# Altium schematic sheet CPU_power.SchDoc
size 420 x 297 mm; SheetNumber: 4; SheetTotal: 17
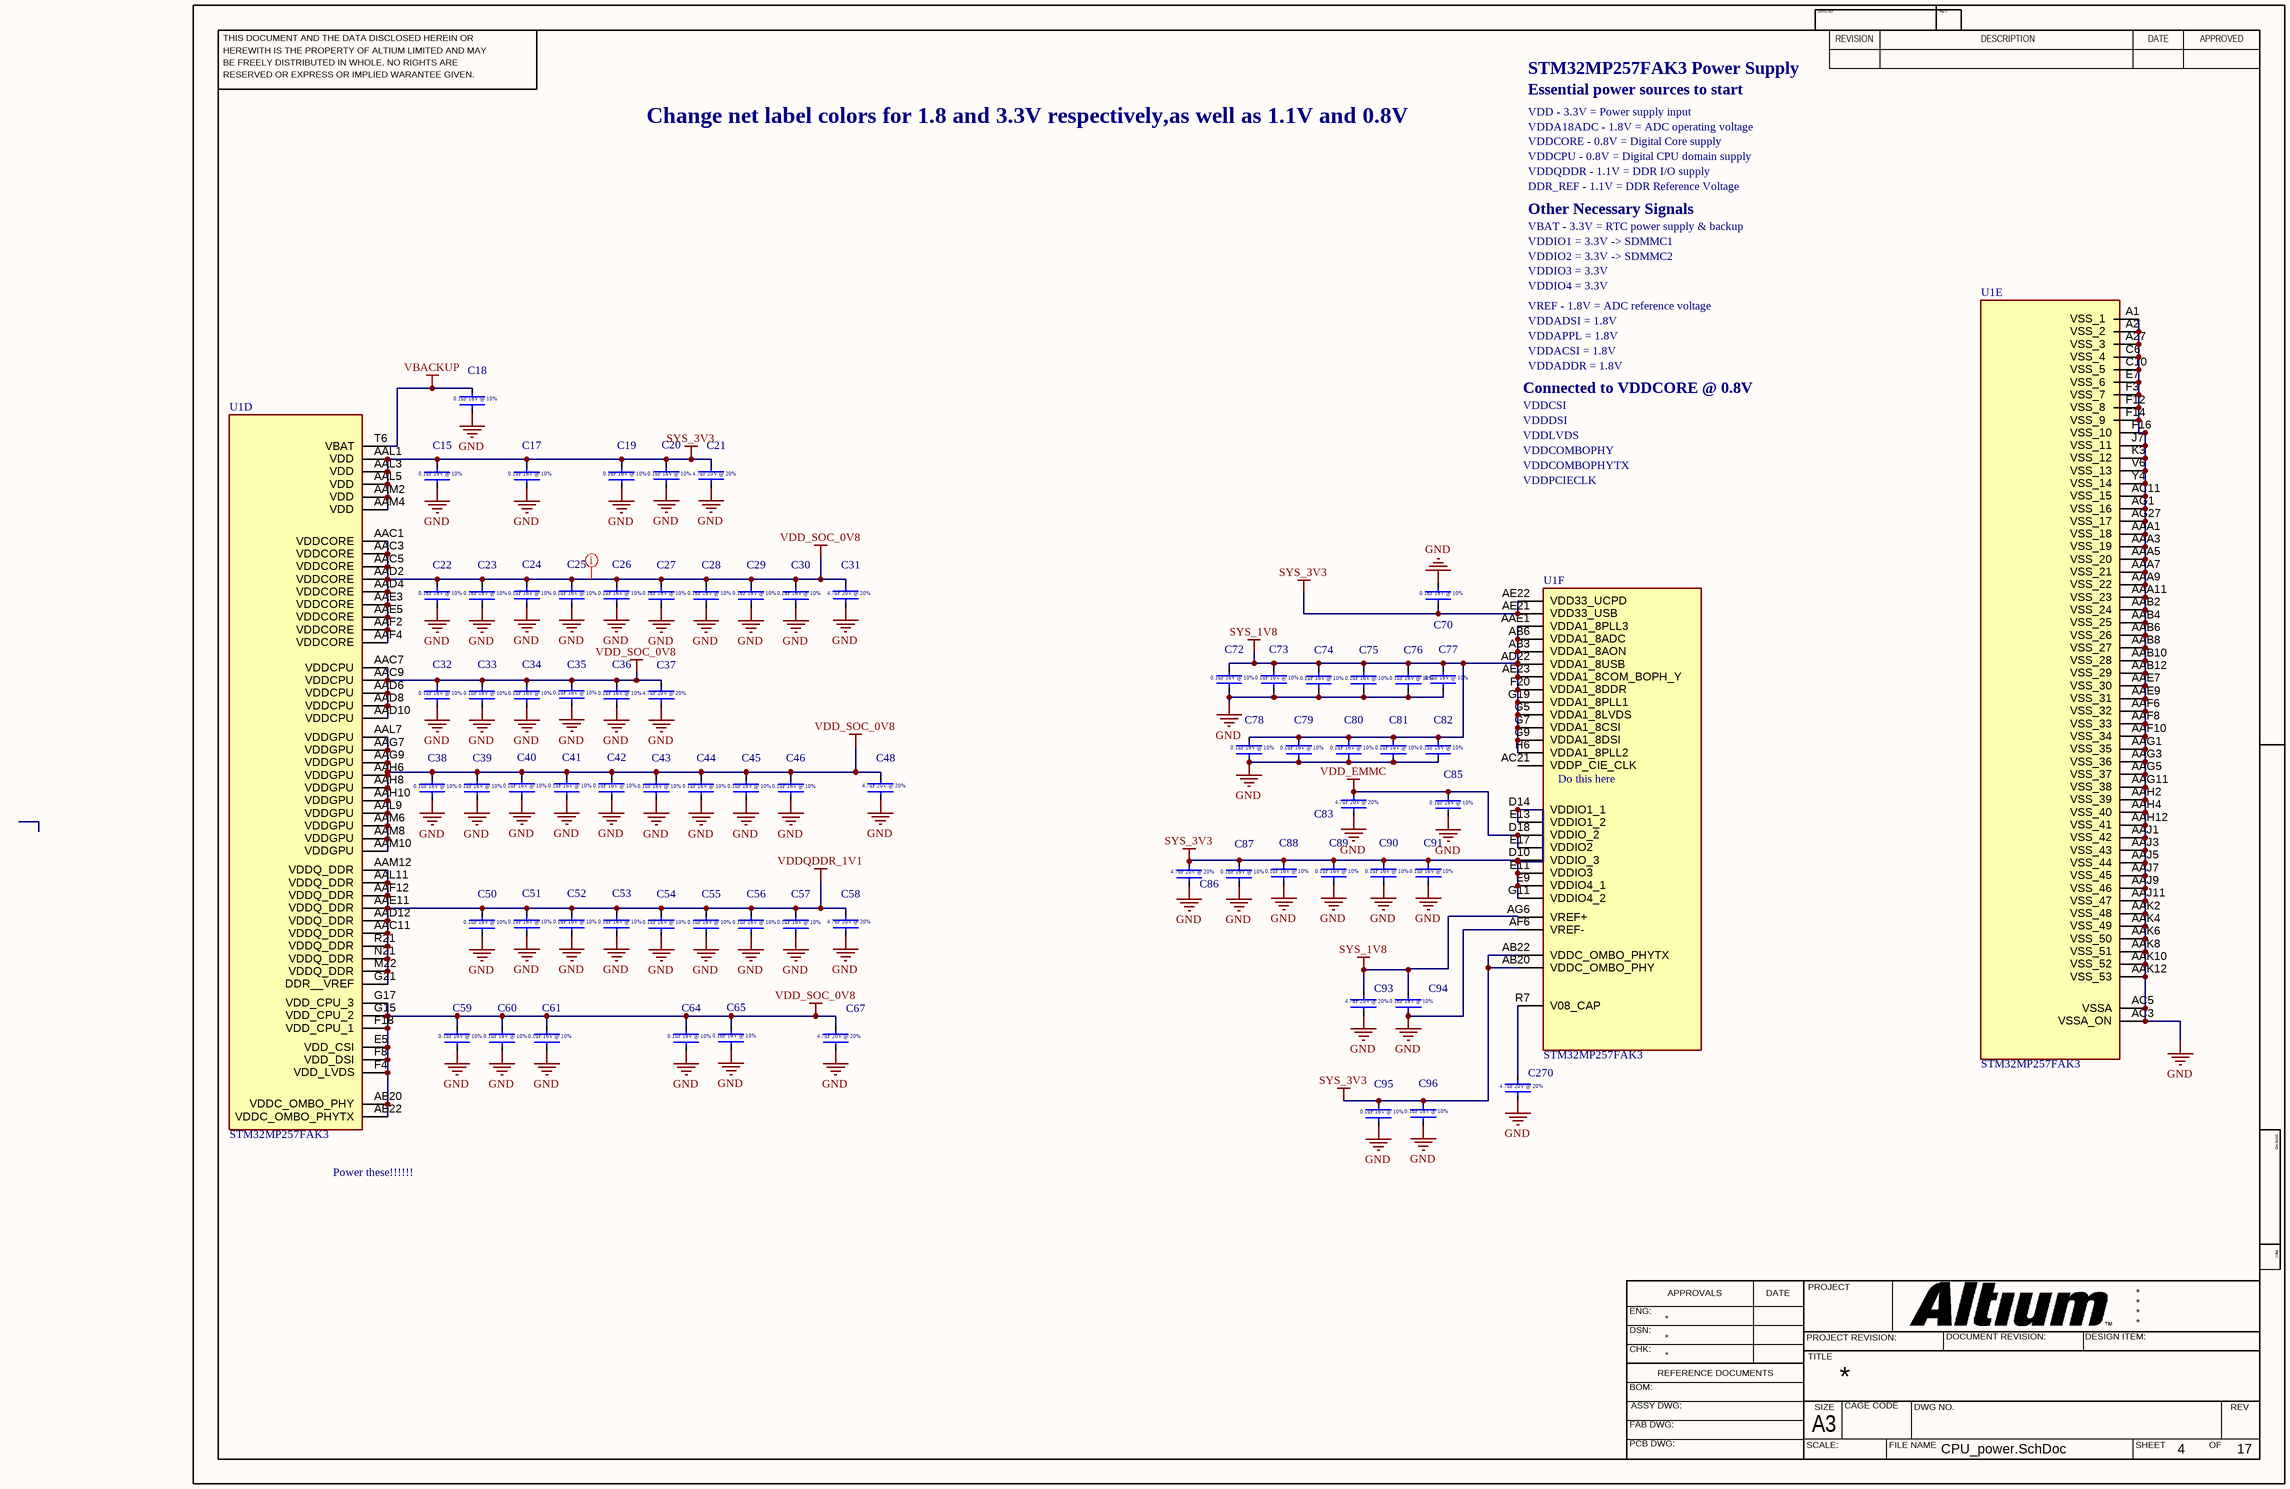
[diagram p0: CPU_power.SchDoc]

## Parts
C15  0.1uF  [CAPC0603X03L]  (value not drawn)
C17  0.1uF  [CAPC0603X03L]  (value not drawn)
C18  0.1uF  [CAPC0603X03L]  (value not drawn)
C19  0.1uF  [CAPC0603X03L]  (value not drawn)
C20  0.1uF  [CAPC0603X03L]  (value not drawn)
C21  4.7uF  [CAPC1005X06L]  (value not drawn)
C22  0.1uF  [CAPC0603X03L]  (value not drawn)
C23  0.1uF  [CAPC0603X03L]  (value not drawn)
C24  0.1uF  [CAPC0603X03L]  (value not drawn)
C25  0.1uF  [CAPC0603X03L]  (value not drawn)
C26  0.1uF  [CAPC0603X03L]  (value not drawn)
C27  0.1uF  [CAPC0603X03L]  (value not drawn)
C28  0.1uF  [CAPC0603X03L]  (value not drawn)
C29  0.1uF  [CAPC0603X03L]  (value not drawn)
C30  0.1uF  [CAPC0603X03L]  (value not drawn)
C31  4.7uF  [CAPC1005X06L]  (value not drawn)
C32  0.1uF  [CAPC0603X03L]  (value not drawn)
C33  0.1uF  [CAPC0603X03L]  (value not drawn)
C34  0.1uF  [CAPC0603X03L]  (value not drawn)
C35  0.1uF  [CAPC0603X03L]  (value not drawn)
C36  0.1uF  [CAPC0603X03L]  (value not drawn)
C37  4.7uF  [CAPC1005X06L]  (value not drawn)
C38  0.1uF  [CAPC0603X03L]  (value not drawn)
C39  0.1uF  [CAPC0603X03L]  (value not drawn)
C40  0.1uF  [CAPC0603X03L]  (value not drawn)
C41  0.1uF  [CAPC0603X03L]  (value not drawn)
C42  0.1uF  [CAPC0603X03L]  (value not drawn)
C43  0.1uF  [CAPC0603X03L]  (value not drawn)
C44  0.1uF  [CAPC0603X03L]  (value not drawn)
C45  0.1uF  [CAPC0603X03L]  (value not drawn)
C46  0.1uF  [CAPC0603X03L]  (value not drawn)
C48  4.7uF  [CAPC1005X06L]  (value not drawn)
C50  0.1uF  [CAPC0603X03L]  (value not drawn)
C51  0.1uF  [CAPC0603X03L]  (value not drawn)
C52  0.1uF  [CAPC0603X03L]  (value not drawn)
C53  0.1uF  [CAPC0603X03L]  (value not drawn)
C54  0.1uF  [CAPC0603X03L]  (value not drawn)
C55  0.1uF  [CAPC0603X03L]  (value not drawn)
C56  0.1uF  [CAPC0603X03L]  (value not drawn)
C57  0.1uF  [CAPC0603X03L]  (value not drawn)
C58  4.7uF  [CAPC1005X06L]  (value not drawn)
C59  0.1uF  [CAPC0603X03L]  (value not drawn)
C60  0.1uF  [CAPC0603X03L]  (value not drawn)
C61  0.1uF  [CAPC0603X03L]  (value not drawn)
C64  0.1uF  [CAPC0603X03L]  (value not drawn)
C65  0.1uF  [CAPC0603X03L]  (value not drawn)
C67  4.7uF  [CAPC1005X06L]  (value not drawn)
C70  0.1uF  [CAPC0603X03L]  (value not drawn)
C72  0.1uF  [CAPC0603X03L]  (value not drawn)
C73  0.1uF  [CAPC0603X03L]  (value not drawn)
C74  0.1uF  [CAPC0603X03L]  (value not drawn)
C75  0.1uF  [CAPC0603X03L]  (value not drawn)
C76  0.1uF  [CAPC0603X03L]  (value not drawn)
C77  0.1uF  [CAPC0603X03L]  (value not drawn)
C78  0.1uF  [CAPC0603X03L]  (value not drawn)
C79  0.1uF  [CAPC0603X03L]  (value not drawn)
C80  0.1uF  [CAPC0603X03L]  (value not drawn)
C81  0.1uF  [CAPC0603X03L]  (value not drawn)
C82  0.1uF  [CAPC0603X03L]  (value not drawn)
C83  4.7uF  [CAPC1005X06L]  (value not drawn)
C85  0.1uF  [CAPC0603X03L]  (value not drawn)
C86  4.7uF  [CAPC1005X06L]  (value not drawn)
C87  0.1uF  [CAPC0603X03L]  (value not drawn)
C88  0.1uF  [CAPC0603X03L]  (value not drawn)
C89  0.1uF  [CAPC0603X03L]  (value not drawn)
C90  0.1uF  [CAPC0603X03L]  (value not drawn)
C91  0.1uF  [CAPC0603X03L]  (value not drawn)
C93  4.7uF  [CAPC1005X06L]  (value not drawn)
C94  0.1uF  [CAPC0603X03L]  (value not drawn)
C95  0.1uF  [CAPC0603X03L]  (value not drawn)
C96  0.1uF  [CAPC0603X03L]  (value not drawn)
C270  4.7uF  [CAPC1005X06L]  (value not drawn)
U1  STM32MP257FAK3  [STM32MP257FAK3]  (parts D,E,F of 7)

## Nets
GND: C15.1 C17.1 C18.1 C19.1 C20.1 C21.1 C22.1 C23.1 C24.1 C25.1 C26.1 C27.1 C28.1 C29.1 C30.1 C31.1 C32.1 C33.1 C34.1 C35.1 C36.1 C37.1 C38.1 C39.1 C40.1 C41.1 C42.1 C43.1 C44.1 C45.1 C46.1 C48.1 C50.1 C51.1 C52.1 C53.1 C54.1 C55.1 C56.1 C57.1 C58.1 C59.1 C60.1 C61.1 C64.1 C65.1 C67.1 C70.2 C72.1 C73.1 C74.1 C75.1 C76.1 C77.1 C78.1 C79.1 C80.1 C81.1 C82.1 C83.1 C85.1 C86.1 C87.1 C88.1 C89.1 C90.1 C91.1 C93.1 C94.1 C95.1 C96.1 C270.1 U1.A1(VSS_1) U1.A2(VSS_2) U1.A27(VSS_3) U1.AAA1(VSS_18) U1.AAA3(VSS_19) U1.AAA5(VSS_20) U1.AAA7(VSS_21) U1.AAA9(VSS_22) U1.AAA11(VSS_23) U1.AAB2(VSS_24) U1.AAB4(VSS_25) U1.AAB6(VSS_26) U1.AAB8(VSS_27) U1.AAB10(VSS_28) U1.AAB12(VSS_29) U1.AAE7(VSS_30) U1.AAE9(VSS_31) U1.AAF6(VSS_32) U1.AAF8(VSS_33) U1.AAF10(VSS_34) U1.AAG1(VSS_35) U1.AAG3(VSS_36) U1.AAG5(VSS_37) U1.AAG11(VSS_38) U1.AAH2(VSS_39) U1.AAH4(VSS_40) U1.AAH12(VSS_41) U1.AAJ1(VSS_42) U1.AAJ3(VSS_43) U1.AAJ5(VSS_44) U1.AAJ7(VSS_45) U1.AAJ9(VSS_46) U1.AAJ11(VSS_47) U1.AAK2(VSS_48) U1.AAK4(VSS_49) U1.AAK6(VSS_50) U1.AAK8(VSS_51) U1.AAK10(VSS_52) U1.AAK12(VSS_53) U1.AC3(VSSA_ON) U1.AC5(VSSA) U1.AC11(VSS_15) U1.AF6(VREF-) U1.AG1(VSS_16) U1.AG27(VSS_17) U1.C6(VSS_4) U1.C10(VSS_5) U1.E7(VSS_6) U1.F3(VSS_7) U1.F12(VSS_8) U1.F14(VSS_9) U1.F16(VSS_10) U1.J7(VSS_11) U1.K3(VSS_12) U1.V6(VSS_13) U1.Y4(VSS_14)
SYS_1V8: C72.2 C73.2 C74.2 C75.2 C76.2 C77.2 C78.2 C79.2 C80.2 C81.2 C82.2 C93.2 C94.2 U1.AAE1(VDDA1_8PLL3) U1.AB3(VDDA1_8AON) U1.AB6(VDDA1_8ADC) U1.AD22(VDDA1_8USB) U1.AE23(VDDA1_8COM_BOPH_Y) U1.AG6(VREF+) U1.F20(VDDA1_8DDR) U1.G5(VDDA1_8LVDS) U1.G7(VDDA1_8CSI) U1.G9(VDDA1_8DSI) U1.G19(VDDA1_8PLL1) U1.H6(VDDA1_8PLL2)
SYS_3V3: C15.2 C17.2 C19.2 C20.2 C21.2 C70.1 C86.2 C87.2 C88.2 C89.2 C90.2 C91.2 C95.2 C96.2 U1.AAL1(VDD) U1.AAL3(VDD) U1.AAL5(VDD) U1.AAM2(VDD) U1.AAM4(VDD) U1.AB20(VDDC_OMBO_PHY) U1.AB22(VDDC_OMBO_PHYTX) U1.AE21(VDD33_USB) U1.AE22(VDD33_UCPD) U1.D10(VDDIO_3) U1.D14(VDDIO1_1) U1.E9(VDDIO4_1) U1.E11(VDDIO3) U1.E13(VDDIO1_2) U1.G11(VDDIO4_2)
VBACKUP: C18.2 U1.T6(VBAT)
VDD_EMMC: C83.2 C85.2 U1.D18(VDDIO_2) U1.E17(VDDIO2)
VDD_SOC_0V8: C22.2 C23.2 C24.2 C25.2 C26.2 C27.2 C28.2 C29.2 C30.2 C31.2 C32.2 C33.2 C34.2 C35.2 C36.2 C37.2 C38.2 C39.2 C40.2 C41.2 C42.2 C43.2 C44.2 C45.2 C46.2 C48.2 C59.2 C60.2 C61.2 C64.2 C65.2 C67.2 U1.AAC1(VDDCORE) U1.AAC3(VDDCORE) U1.AAC5(VDDCORE) U1.AAC7(VDDCPU) U1.AAC9(VDDCPU) U1.AAD2(VDDCORE) U1.AAD4(VDDCORE) U1.AAD6(VDDCPU) U1.AAD8(VDDCPU) U1.AAD10(VDDCPU) U1.AAE3(VDDCORE) U1.AAE5(VDDCORE) U1.AAF2(VDDCORE) U1.AAF4(VDDCORE) U1.AAG7(VDDGPU) U1.AAG9(VDDGPU) U1.AAH6(VDDGPU) U1.AAH8(VDDGPU) U1.AAH10(VDDGPU) U1.AAL7(VDDGPU) U1.AAL9(VDDGPU) U1.AAM6(VDDGPU) U1.AAM8(VDDGPU) U1.AAM10(VDDGPU) U1.AB20(VDDC_OMBO_PHY) U1.AB22(VDDC_OMBO_PHYTX) U1.E5(VDD_CSI) U1.F4(VDD_LVDS) U1.F8(VDD_DSI) U1.F18(VDD_CPU_1) U1.G15(VDD_CPU_2) U1.G17(VDD_CPU_3)
VDDQDDR_1V1: C50.2 C51.2 C52.2 C53.2 C54.2 C55.2 C56.2 C57.2 C58.2 U1.AAC11(VDDQ_DDR) U1.AAD12(VDDQ_DDR) U1.AAE11(VDDQ_DDR) U1.AAF12(VDDQ_DDR) U1.AAL11(VDDQ_DDR) U1.AAM12(VDDQ_DDR) U1.G21(DDR__VREF) U1.M22(VDDQ_DDR) U1.N21(VDDQ_DDR) U1.R21(VDDQ_DDR)
NetC270_2: C270.2 U1.R7(V08_CAP)

Not connected (* = marked no-connect by the designer): U1 AC21(VDDP_CIE_CLK)

## Layout directives
net class MPU_PWR: VDD_SOC_0V8

## Notes on the sheet
- STM32MP257FAK3 Power Supply
- VDD - 3.3V = Power supply input
- Essential power sources to start
- Change net label colors for 1.8 and 3.3V respectively,as well as 1.1V and 0.8V
- VDDQDDR - 1.1V = DDR I/O supply
- VDDA18ADC - 1.8V = ADC operating voltage
- VDDCORE - 0.8V = Digital Core supply
- VDDCPU - 0.8V = Digital CPU domain supply
- VBAT - 3.3V = RTC power supply & backup
- Other Necessary Signals
- VDDIO1 = 3.3V -> SDMMC1
- DDR_REF - 1.1V = DDR Reference Voltage
- VREF - 1.8V = ADC reference voltage
- VDDIO2 = 3.3V -> SDMMC2
- VDDIO3 = 3.3V
- VDDIO4 = 3.3V
- VDDADSI = 1.8V
- VDDAPPL = 1.8V
- VDDACSI = 1.8V
- VDDADDR = 1.8V
- Connected to VDDCORE @ 0.8V
- VDDCSI
- VDDDSI
- VDDLVDS
- VDDCOMBOPHY
- VDDPCIECLK
- VDDCOMBOPHYTX
- (near U1) Do this here
- Power these!!!!!!
- THIS DOCUMENT AND THE DATA DISCLOSED HEREIN OR
- HEREWITH IS THE PROPERTY OF ALTIUM LIMITED AND MAY
- DWG NO:
- REVISION
- REV:
- DESCRIPTION
- DATE
- APPROVED
- BE FREELY DISTRIBUTED IN WHOLE. NO RIGHTS ARE
- RESERVED OR EXPRESS OR IMPLIED WARANTEE GIVEN.
- ENG:
- APPROVALS
- PROJECT
- DSN:
- CHK:
- REFERENCE DOCUMENTS
- PROJECT REVISION:
- TITLE
- DOCUMENT REVISION:
- DESIGN ITEM:
- BOM:
- FAB DWG:
- PCB DWG:
- ASSY DWG:
- SCALE:
- A3
- SIZE
- CAGE CODE
- FILE NAME
- DWG NO.
- SHEET
- OF
- REV
- (in symbol CL05A475MO5NUNC) 4.7uF 20V @ 20%
- (in symbol GRM033R61E104KE14J) 0.1uF 16V @ 10%

## Library data of the parts
C15 C17-C20 C22-C30 C32-C36 C38-C46 C50-C57 C59-C61 C64 C65 C70 C72-C82 C85 C87-C91 C94-C96 = GRM033R61E104KE14J: 0.1 µF ±10% 25V Ceramic Capacitor X5R 0201 (0603 Metric)0.1 µF ±10% 25V Ceramic Capacitor X5R 0201 (0603 Metric); Parameter 1: MPU CAPS
C21 C31 C37 C48 C58 C67 C83 C86 C93 C270 = CL05A475MO5NUNC: 4.7 µF ±20% 16V Ceramic Capacitor X5R 0402 (1005 Metric); Parameter 1: MPU CAPS
U1 = STM32MP257FAK3: Integrated Circuit; Manufacturer_Name: STMicroelectronics; Datasheet Link: https://www.digikey.ph/en/products/detail/stmicroelectronics/STM32MP257FAK3/24883094; Height: 1mm; Manufacturer_Part_Number: STM32MP257FAK3; Mouser Part Number: 511-STM32MP257FAK3; Mouser Price/Stock: https://www.mouser.co.uk/ProductDetail/STMicroelectronics/STM32MP257FAK3?qs=i8QVZAFTkqQulHX8Hxkfng%3D%3D; Arrow Part Number: STM32MP257FAK3; Arrow Price/Stock: https://www.arrow.com/en/products/stm32mp257fak3/stmicroelectronics?utm_currency=USD&region=nac